# Altium schematic sheet 0-10V_Converter.SchDoc: Access Control
size A; DrawnBy: Q.Thang & T.Khoa; Revision: V1.0.1; SheetNumber: 14; SheetTotal: 16
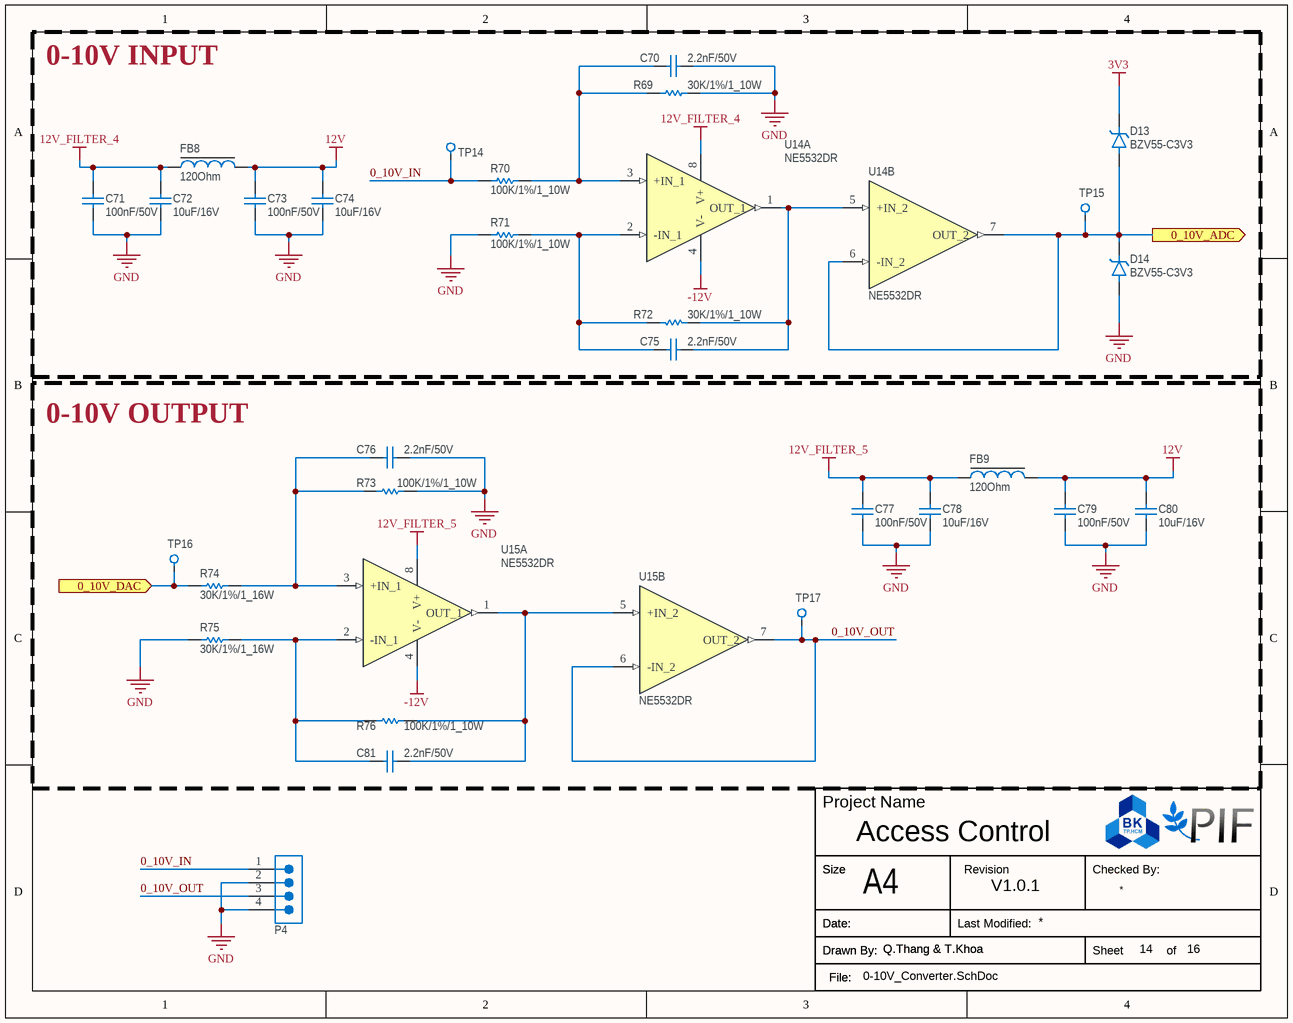
[diagram p0: 0-10V_Converter.SchDoc]

## Parts
C70  2.2nF/50V  [CAP_0603]
C71  100nF/50V  [CAP_0603]
C72  10uF/16V  [CAP_0603]
C73  100nF/50V  [CAP_0603]
C74  10uF/16V  [CAP_0603]
C75  2.2nF/50V  [CAP_0603]
C76  2.2nF/50V  [CAP_0603]
C77  100nF/50V  [CAP_0603]
C78  10uF/16V  [CAP_0603]
C79  100nF/50V  [CAP_0603]
C80  10uF/16V  [CAP_0603]
C81  2.2nF/50V  [CAP_0603]
D13  BZV55-C3V3  [SOD-80]
D14  BZV55-C3V3  [SOD-80]
FB8  120Ohm  [Ferrite_Bead_0805]
FB9  120Ohm  [Ferrite_Bead_0805]
P4  3.81mm_4P  [Terminal_Block_3.81mm_4P]  (value not drawn)
R69  30K/1%/1_10W  [Resistor_0603]
R70  100K/1%/1_10W  [Resistor_0603]
R71  100K/1%/1_10W  [Resistor_0603]
R72  30K/1%/1_10W  [Resistor_0603]
R73  100K/1%/1_10W  [Resistor_0603]
R74  30K/1%/1_16W  [RESISTOR_0402]
R75  30K/1%/1_16W  [RESISTOR_0402]
R76  100K/1%/1_10W  [Resistor_0603]
TP14  0-10V_IN  [TestPoint_THTPad_D1.5mm_Drill0.7mm]  (value not drawn)
TP15  0-10V_ADC  [TestPoint_THTPad_D1.5mm_Drill0.7mm]  (value not drawn)
TP16  0-10V_DAC  [TestPoint_THTPad_D1.5mm_Drill0.7mm]  (value not drawn)
TP17  0-10V_Output  [TestPoint_THTPad_D1.5mm_Drill0.7mm]  (value not drawn)
U14  NE5532DR  [SOIC-8]  (parts A,B of 2)
U15  NE5532DR  [SOIC-8]  (parts A,B of 2)

## Blocks framed on the sheet
0-10V INPUT: C70-C75 D13 D14 FB8 R69-R72 TP14 TP15 U14
0-10V OUTPUT: C76-C81 FB9 R73-R76 TP16 TP17 U15

## Ports
0_10V_ADC (out, see Overview_Schematic[6C], DAC_ADC_External[1B]), 0_10V_DAC (in, see Overview_Schematic[6C], DAC_ADC_External[3C])

## Nets
3V3: D13.C
12V: C73.2 C74.2 C79.2 C80.2 FB8.2 FB9.2
12V_FILTER_4: C71.2 C72.2 FB8.1 U14.8(V+)
12V_FILTER_5: C77.2 C78.2 FB9.1 U15.8(V+)
-12V: U14.4(V-) U15.4(V-)
GND: C70.2 C71.1 C72.1 C73.1 C74.1 C76.2 C77.1 C78.1 C79.1 C80.1 D14.A P4.2 P4.4 R69.2 R71.1 R73.2 R75.1
0_10V_ADC: D13.A D14.C TP15.1 U14.6(-IN_2) U14.7(OUT_2) ; port 0_10V_ADC
0_10V_DAC: R74.1 TP16.1 ; port 0_10V_DAC
0_10V_IN: P4.1 R70.1 TP14.1
0_10V_OUT: P4.3 TP17.1 U15.6(-IN_2) U15.7(OUT_2)
NetC70_1: C70.1 R69.1 R70.2 U14.3(+IN_1)
NetC75_1: C75.1 R71.2 R72.1 U14.2(-IN_1)
NetC75_2: C75.2 R72.2 U14.1(OUT_1) U14.5(+IN_2)
NetC76_1: C76.1 R73.1 R74.2 U15.3(+IN_1)
NetC81_1: C81.1 R75.2 R76.1 U15.2(-IN_1)
NetC81_2: C81.2 R76.2 U15.1(OUT_1) U15.5(+IN_2)

## Notes on the sheet
- Project Name
- Size
- A4
- Revision
- Checked By:
- Drawn By:
- Date:
- File:
- Last Modified:
- Sheet
- of

## Library data of the parts
C70 C75 C76 C81 = Ceramic_Cap_2.2nF_50V_0603: CAP, size 0603, 2.2nF, 50V; Supply Part Number: CC0603KRX7R9BB222; Supply Name: tme; Datasheet: *; Supply URL: http://www.tme.vn/Product.aspx?id=1310#page=pro_info
C71 C73 C77 C79 = Ceramic_Cap_100nF_50V_0603: CAP, size 0603, 100nF, 50V; Supply Part Number: Tụ Gốm 0603 100nF (0.1uF) 50V; Supply Name: Thegioiic; Datasheet: *; Supply URL: https://www.thegioiic.com/tu-gom-0603-100nf-0-1uf-50v
C72 C74 C78 C80 = Ceramic_Cap_10uF_16V_0603: CAP, size 0603, 10uF, 16V; Supply Part Number: Tụ Gốm 0603 10uF 16V; Supply Name: Thegioiic; Datasheet: *; Supply URL: https://www.thegioiic.com/tu-gom-0603-10uf-16v
D13 D14 = Diode_BZV55C3V3: DIODE ZENER 3.3V 500 mW; Supply Name: tme; Datasheet: https://www.alldatasheet.com/datasheet-pdf/view/17578/PHILIPS/BZV55.html; Supply Part Number: BZV55-C3V3; Supply URL: http://www.tme.vn/Product.aspx?id=1871#page=pro_info
FB8 FB9 = Ferrite_Bead_120Ohm_2A_0805: Ferrite Bead, size 0805, 120Ohm, 2A; Supply Part Number: CBW201209U121T Ferrite Beads 2A 120 Ohm 0805; Supply Name: Thegioiic; Supply URL: https://www.thegioiic.com/cbw201209u121t-ferrite-beads-2a-120-ohm-0805
P4 = Terminal_Block_3.81mm_4P: Terminal Block THT, pitch 3.81mm, 4p, 300V 10A; Supply Part Number: UL-3.81-4-R Terminal Block Plug-in Hàn PCB 4 Chân Cong 3.81mm 300V 10A ULO; Supply Name: Thegioiic; ComponentLink1Description: Website Link; ComponentLink1URL: https://www.we-online.com/redexpert/article/691322310004?ad; ComponentLink2Description: Datasheet Link; ComponentLink2URL: https://www.we-online.com/redexpert/spec/691322310004?ad; Supply URL: https://www.thegioiic.com/ul-3-81-4-r-terminal-block-plug-in-han-pcb-4-chan-cong-3-81mm-300v-10a-ulo
R69 R72 = Res_30K_0603_1%: Resistor 0603 30KOhm 1% 1_10W; Supply Part Number: Điện Trở 30 KOhm 0603 1%; Supply Name: LinhkienX; Supply URL: https://linhkienx.com/vi/dien-tro-30-kohm-0603-1-
R70 R71 R73 R76 = Res_100K_0603_1%: Resistor 0603 100KOhm 1% 1_10W; Supply Part Number: Điện Trở 100 KOhm 0603 1%; Supply Name: Thegioiic; Supply URL: https://www.thegioiic.com/dien-tro-100-kohm-0603-1-
R74 R75 = Res_30K_0402_1%: Resistor 0402 30KOhm 1% 1_16W; Supply Part Number: Điện Trở 30 KOhm 0402 1%; Supply Name: Thegioiic; Supply URL: https://www.thegioiic.com/dien-tro-30-kohm-0402-1-
TP14-TP17 = Testpoint_TH: Test Point TEST-1BK; Supply Name: BanLinhKien; Datasheet: *; Supply Part Number: Test Point TEST-1BK; Supply URL: https://banlinhkien.com/test-point-test1bk-mau-den-5c-p18255999.html
U14 U15 = NE5532DR: Low Noise Single/Dual Operational Amplifier - SOIC-8; Supply Name: tme; Datasheet: https://www.ti.com/lit/ds/symlink/ne5532.pdf; Supply Part Number: NE5532DR; Supply URL: http://www.tme.vn/Product.aspx?id=2122#page=pro_info